# Altium schematic sheet SV601187A.SchDoc
size 431 x 279 mm; Date: Not shown in title block; ApprovedBy: Not shown in title block; CheckedBy: Not shown in title block; Author: Not shown in title block; CompanyName: Not shown in title block; Engineer: Not shown in title block; Organization: Not shown in title block; Address1: Not shown in title block; Address2: Not shown in title block; Address3: Not shown in title block; Address4: Not shown in title block; DocumentNumber: 1; Revision: Use project parameter SCH_Rev; SheetNumber: 1; SheetTotal: 1; PageSetup: Record=PageOptions|CenterHorizontal=True|CenterVertical=True|PrintScale=0.64|XCorrection=1.00|YCorrection=1.00|PrintKind=0|BorderSize=5000000|LeftOffset=0|BottomOffset=0|Orientation=2|PaperLength=1000|PaperWidth=1000|Scale=100|PaperSource=15|PrintQuality=600|MediaType=1|DitherType=10|PaperKind=Letter|PrintScaleMode=1; CurrentTime: Not shown in title block; CurrentDate: Not shown in title block; Time: Not shown in title block; DocumentFullPathAndName: Not shown in title block; DocumentName: Not shown in title block; ModifiedDate: Not shown in title block; ImagePath: Not shown in title block
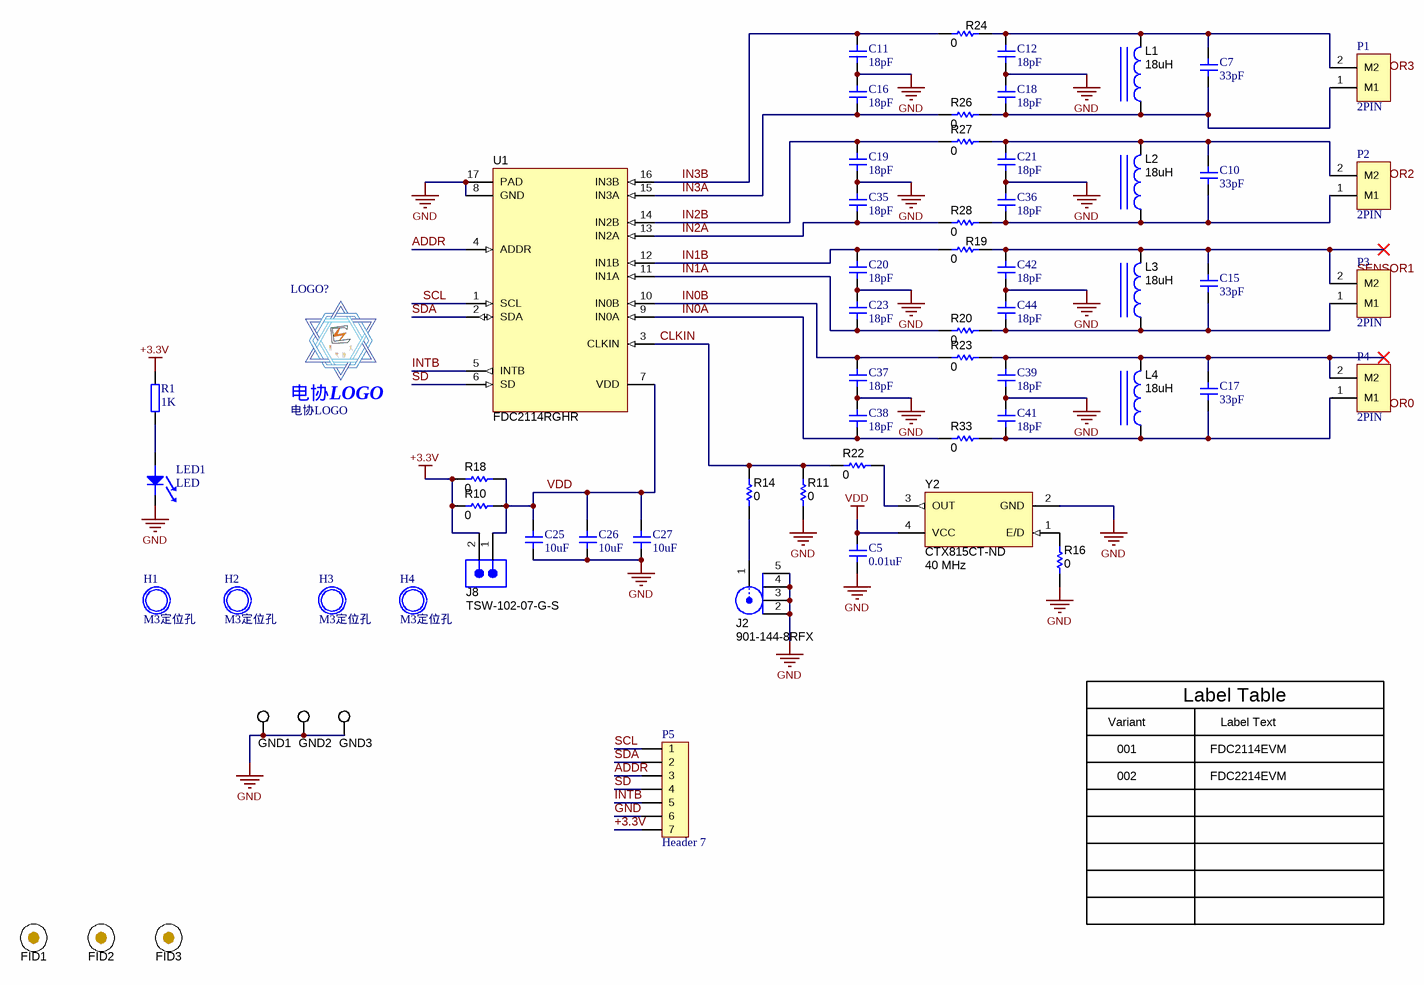
[diagram p0: SV601187A.SchDoc]

## Parts
C5  0.01uF  [0805C]
C7  33pF  [0805C]
C10  33pF  [0805C]
C11  18pF  [0805C]
C12  18pF  [0805C]
C15  33pF  [0805C]
C16  18pF  [0805C]
C17  33pF  [0805C]
C18  18pF  [0805C]
C19  18pF  [0805C]
C20  18pF  [0805C]
C21  18pF  [0805C]
C23  18pF  [0805C]
C25  10uF  [0805C]
C26  10uF  [0805C]
C27  10uF  [0805C]
C35  18pF  [0805C]
C36  18pF  [0805C]
C37  18pF  [0805C]
C38  18pF  [0805C]
C39  18pF  [0805C]
C41  18pF  [0805C]
C42  18pF  [0805C]
C44  18pF  [0805C]
FID1  Fiducial  [Fiducial10-20]  (value not drawn)
FID2  Fiducial  [Fiducial10-20]  (value not drawn)
FID3  Fiducial  [Fiducial10-20]  (value not drawn)
GND1  5015  [Testpoint_Keystone_Miniature]  (value not drawn)
GND2  5015  [Testpoint_Keystone_Miniature]  (value not drawn)
GND3  5015  [Testpoint_Keystone_Miniature]  (value not drawn)
H1  M3定位孔  [定位孔]
H2  M3定位孔  [定位孔]
H3  M3定位孔  [定位孔]
H4  M3定位孔  [定位孔]
J2  901-144-8RFX  [Amphenol_901-144-8RFX]
J8  TSW-102-07-G-S  [TSW-102-07-G-S]
L1  18uH  [CMH322522]
L2  18uH  [CMH322522]
L3  18uH  [CMH322522]
L4  18uH  [CMH322522]
LED1  LED  [0805LED(GREEN)]
LOGO?  电协LOGO  [电协LOGO]
P1  2PIN  [接线端子(2.54mm)-2PIN]
P2  2PIN  [接线端子(2.54mm)-2PIN]
P3  2PIN  [接线端子(2.54mm)-2PIN]
P4  2PIN  [接线端子(2.54mm)-2PIN]
P5  Header 7  [Header 7]
R1  1K  [0805R]
R10  0  [0805_HV]
R11  0  [0805_HV]
R14  0  [0805_HV]
R16  0  [0805_HV]
R18  0  [0805_HV]
R19  0  [0805_HV]
R20  0  [0805_HV]
R22  0  [0805_HV]
R23  0  [0805_HV]
R24  0  [0805_HV]
R26  0  [0805_HV]
R27  0  [0805_HV]
R28  0  [0805_HV]
R33  0  [0805_HV]
U1  FDC2114RGHR  [RGH0016A]
Y2  CTX815CT-ND  Frequency: 40 MHz  [OSC_CTS_625]

## Nets
+3.3V: J8.2 P5.7 R1.2 R10.1 R18.1
GND: C5.1 C11.1 C12.1 C16.2 C18.2 C19.1 C20.1 C21.1 C23.2 C25.1 C26.1 C27.1 C35.2 C36.2 C37.1 C38.2 C39.1 C41.2 C42.1 C44.2 GND1.1 GND2.1 GND3.1 J2.2 J2.3 J2.4 J2.5 LED1.2 P5.6 R11.2 R16.1 U1.8(GND) U1.17(PAD) Y2.2(GND)
VDD: C5.2 C25.2 C26.2 C27.2 J8.1 R10.2 R18.2 U1.7(VDD) Y2.4(VCC)
ADDR: P5.3 U1.4(ADDR)
CLKIN: R11.1 R14.1 R22.2 U1.3(CLKIN)
IN0A: C38.1 R33.1 U1.9(IN0A)
IN0B: C37.2 R23.1 U1.10(IN0B)
IN1A: C23.1 R20.1 U1.11(IN1A)
IN1B: C20.2 R19.1 U1.12(IN1B)
IN2A: C35.1 R28.1 U1.13(IN2A)
IN2B: C19.2 R27.1 U1.14(IN2B)
IN3A: C16.1 R26.1 U1.15(IN3A)
IN3B: C11.2 R24.1 U1.16(IN3B)
INTB: P5.5 U1.5(INTB)
SCL: P5.1 U1.1(SCL)
SD: P5.4 U1.6(SD)
SDA: P5.2 U1.2(SDA)
NetC7_1: C7.1 C18.1 L1.1 P1.1(M1) R26.2
NetC7_2: C7.2 C12.2 L1.2 P1.2(M2) R24.2
NetC10_1: C10.1 C36.1 L2.1 P2.1(M1) R28.2
NetC10_2: C10.2 C21.2 L2.2 P2.2(M2) R27.2
NetC15_1: C15.1 C44.1 L3.1 P3.1(M1) R20.2
NetC15_2: C15.2 C42.2 L3.2 P3.2(M2) R19.2
NetC17_1: C17.1 C41.1 L4.1 P4.1(M1) R33.2
NetC17_2: C17.2 C39.2 L4.2 P4.2(M2) R23.2
NetJ2_1: J2.1 R14.2
NetLED1_1: LED1.1 R1.1
NetR16_2: R16.2 Y2.1(E/D)
NetR22_1: R22.1 Y2.3(OUT)

## Notes on the sheet
- Label Table
- Variant
- 001
- Label Text
- FDC2114EVM
- 002
- FDC2214EVM
- Labels drawn without touching a wire or pin: SENSOR0, SENSOR1, SENSOR2, SENSOR3
- Drawn By:
- SVN Rev:
- Number:
- Rev:
- Sheet Title:
- File:
- Project Title:
- Designed for:
- Assembly Variant:
- Mod. Date:
- Sheet:
- Size:
- of
- B
- http://www.ti.com
- Texas Instruments and/or its licensors do not warrant the accuracy or completeness of this specification or any information contained therein. Texas Instruments and/or its licensors do not warrant that this design will meet the specifications, will be suitable for your application or fit for any particular purpose, or will operate in an implementation. Texas Instruments and/or its licensors do not warrant that the design is production worthy. You should completely validate and test your design implementation to confirm the system functionality for your application.
- Engineer:
- Contact:
- ? Texas Instruments

## Library data of the parts
C5 C7 C10-C12 C15-C21 C23 C25-C27 C35-C39 C41 C42 C44 = Cap1: 无极贴片电容
FID1-FID3 = Fiducial: Fiducial mark.  There is nothing to buy or mount.; SymbolCreator: codlsc; SymbolVersion: 2009-11-4; CompType: Fiducial; Publisher: National Semiconductor; LatestRevisionDate: 2011-09-19; LatestRevisionNote: Added Alternate PartNumber and Alternate Manufacturer parameters to appropriate components.; ComponentLink1URL: Paste URL for datasheet here; Manufacturer: N/A; MountType: N/A; PackageReference: Fiducial; PartNumber: N/A; ClassName: FiducialMark
GND1-GND3 = 5015: Test Point, Miniature, SMT; Manufacturer: Keystone; CompType: Test Point Loop; U/M: EA; SymbolVersion: 2008-07-10; PartNumber: 5015; Value: SMT; PackageReference: Testpoint_Keystone_Miniature; RoHS: Y; MountType: SMT; ComponentLink1Description: Datasheet Link; ComponentLink1URL: http://www.keyelco.com/userAssets/store/files/5015.PDF; Publisher: Texas Instruments; LatestRevisionDate: 2014-09-23; Supplier 1: Digi-Key; Supplier Part Number 1: 5015KCT-ND
J2 = 901-144-8RFX: SMA Straight Jack, Gold, 50 Ohm, TH; Manufacturer: Amphenol RF; SymbolCreator: X0208326; U/M: EA; SymbolVersion: 2012-12-24; PartNumber: 901-144-8RFX; PackageReference: SMA Straight Jack, TH; CompType: JACK; RoHS: Y; MountType: TH; ComponentLink1Description: Datasheet Link; ComponentLink1URL: http://www.amphenolinfocom.eu/NavData/Drawings/C901-144-8RFX.pdf; Publisher: Texas Instruments; LatestRevisionDate: 2015-02-17; Supplier 1: Digi-Key; Supplier Part Number 1: ARFX1231-ND; Supplier 2: Mouser; Supplier Part Number 2: 523-901-144-8RFX; Supplier 3: Farnell; Supplier Part Number 3: 1339820
J8 = TSW-102-07-G-S: Header, TH, 100mil, 2x1, Gold plated, 230 mil above insulator; Manufacturer: Samtec, Inc.; SymbolCreator: a0412235; U/M: EA; SymbolVersion: 2013-03-14; PartNumber: TSW-102-07-G-S; ClassName: Header; CompType: Header; RoHS: Y; PackageReference: TSW-102-07-G-S; MountType: TH; ComponentLink1Description: Datasheet Link; ComponentLink1URL: http://samtec.com/ftppub/pdf/TSW_TH.PDF; Publisher: Texas Instruments; LatestRevisionDate: 2013-04-23; Supplier 1: Digi-Key; Supplier Part Number 1: SAM1029-02-ND
L1-L4 = CMH322522-180KL: Inductor, Shielded, Ferrite, 18 μH, 0.12 A, 3.3 ohm, SMD; Manufacturer: Bourns; Ind_H: 18.0E-6; ValueDisplayed: 18μH; Imax_A: 0.12; Irms: 0.12A @ 20C rise; DCR_ohm: 3.3; Value1: 3.3 ohm; Value2: 0.12A; SymbolVersion: 2008-07-23; CompType: Inductor; Value: 18uH; PartNumber: CMH322522-180KL; Technology: Shielded; MountType: SMT; Material: Ferrite; PackageReference: 3.2x2.2x2.5mm; Published: 2008-06-26; Publisher: Texas Instruments; LatestRevisionDate: 2015-04-21; ComponentLink1Description: Datasheet link; ComponentLink1URL: http://www.bourns.com/data/global/pdfs/CMH322522.pdf; RoHS: Y; Supplier 1: Digi-Key; Supplier Part Number 1: CMH322522-180KLCT-ND; Supplier 2: Mouser; Supplier Part Number 2: 652-CMH322522-180KL
LED1 = LED: 发光二极管
P1-P4 = 接线端子-2PIN
P5 = Header 7: 排针
R1 = Res: 电阻
R10 R11 R14 R16 R18-R20 R22-R24 R26-R28 R33 = CRCW08050000Z0EA: RES, 0 ohm, 5%, 0.125W, 0805; Manufacturer: Vishay-Dale; CompType: Resistor; Value_Code: 0000; Tolerance_%: 5; Power_W: 0.125; VDC_V: 150; TempCo: 200 ppm/C; EIA_Code: E24; U/M: EA; SymbolVersion: 2009-05-29; Value: 0; PartNumber: CRCW08050000Z0EA; PackageReference: 0805; RoHS: Y; Res_ohm: 0; Value1: 5%; Value2: 0.125W; MountType: SMT; Technology: Thick Film; Published: 2008-06-26; Publisher: Texas Instruments; LatestRevisionDate: 2014-04-18; ComponentLink1Description: Datasheet link; ComponentLink1URL: http://www.vishay.com/docs/20035/dcrcwe3.pdf; Supplier 1: Digi-Key; Supplier Part Number 1: 541-0.0ACT-ND; Supplier 2: Mouser; Supplier Part Number 2: 71-CRCW0805-0-E3; Supplier 3: Farnell; Supplier Part Number 3: 1469846
U1 = FDC2114RGHR: Multi-Channel 12/26-Bit Capacitance to Digital Converter (FDC) for Capacitive Sensing, RGH0016A; Manufacturer: Texas Instruments; SymbolCreator: a0411947; CompType: IC; U/M: EA; SymbolVersion: 2014-04-21; PartNumber: FDC2114RGHR; PackageReference: RGH0016A; MountType: SMT; ComponentLink1Description: Datasheet Link; ComponentLink1URL: https://sps06.itg.ti.com/sites/KMS/crossdivteams/altium/docs/ComponentDatasheets/2015-03-12 - FDC2112_FDC2114_SNOSCZ5.pdf; RoHS: Y; Publisher: Texas Instruments; LatestRevisionDate: 2015-03-20; Alternate Manufacturer: Texas Instruments
Y2 = 625L3C040M00000: OSC, 40 MHz, 3.3 V, SMD; Manufacturer: CTS Electrocomponents; SymbolCreator: a0411947; CompType: Oscillator; U/M: EA; TaMin_C: -20; TaMax_C: 70; Frequency Stability: ±50ppm; SymbolVersion: 2013-04-01; PartNumber: 625L3C040M00000; PackageReference: 2.5x1x2.5mm; MountType: SMT; RoHS: Y; ComponentLink1Description: Datasheet Link; ComponentLink1URL: http://www.ctscorp.com/components/Datasheets/008-0329-0.pdf; Publisher: Texas Instruments; LatestRevisionDate: 2015-02-04; Supplier 1: Digi-Key; Supplier Part Number 1: CTX815CT-ND; Supplier 2: Mouser; Supplier Part Number 2: 774-625L3C040M00000